# Altium project Tray2.PrjPcb (part 1 of 2)
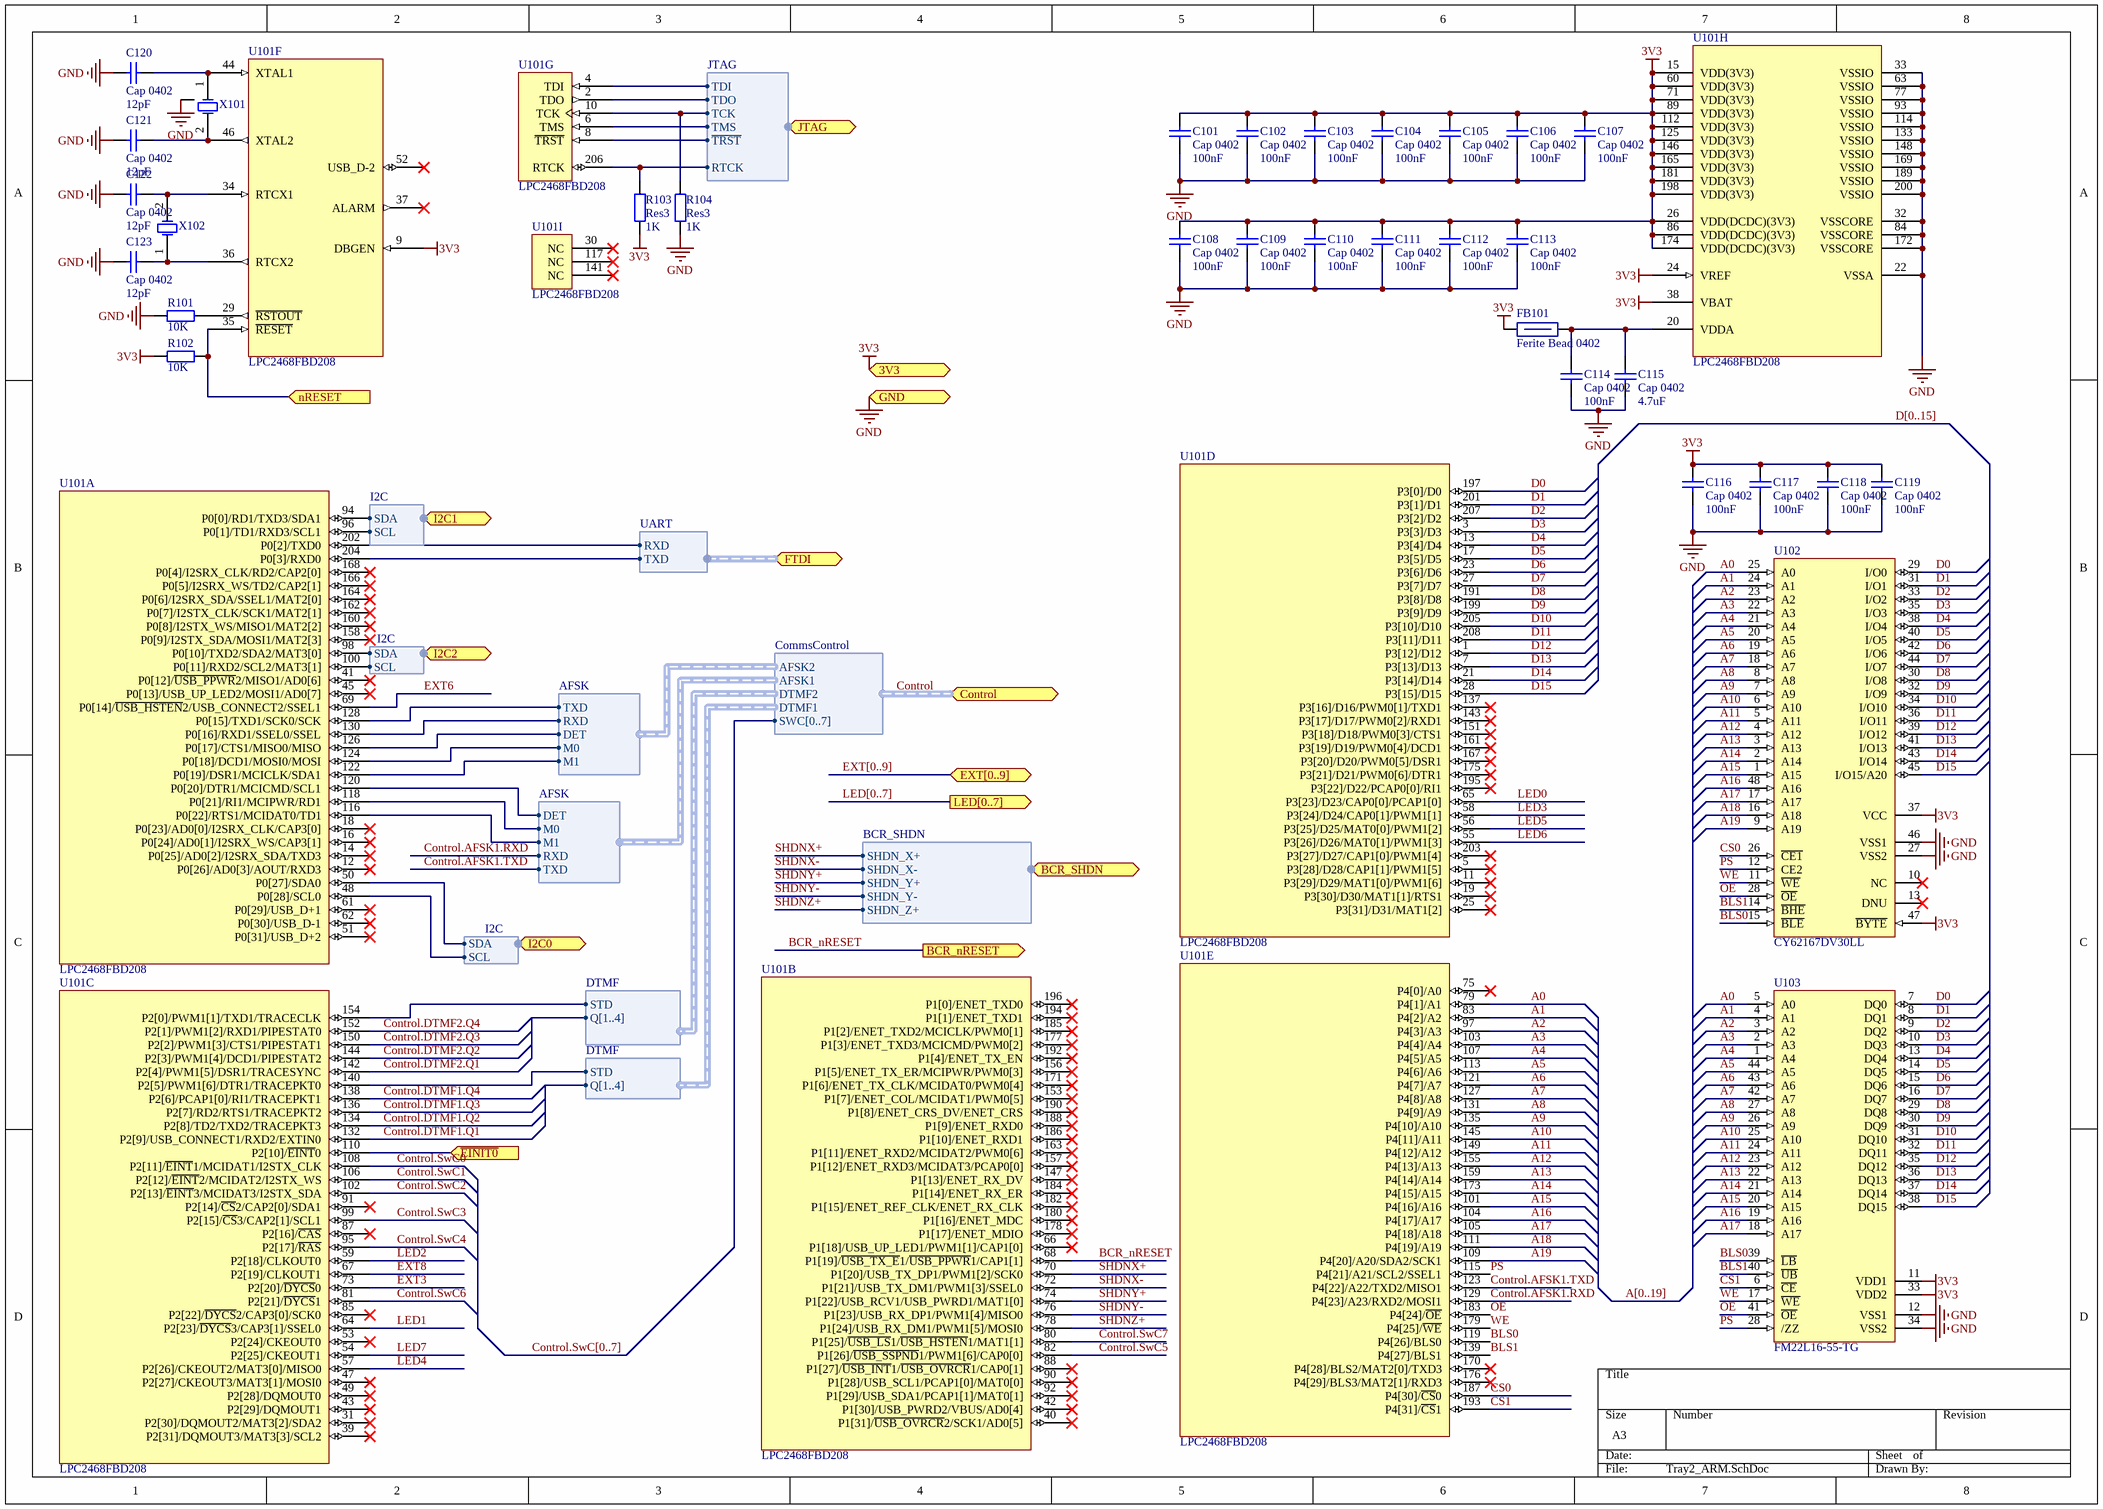
[diagram p0: Tray2_ARM.SchDoc]
7 sheets, 173 parts. Net scope: strictly hierarchical (ports join the sheet entries above them; power ports are local).
Board files: Temp_CSC.PcbDoc, Temp_PowerBoard.PcbDoc, Tray2.PcbDoc, Temp_BCR.PcbDoc
Sheets:
  Tray2_ARM.SchDoc
  Tray2_Comms_AFSK.SchDoc
  Tray2_Comms_Beacon.SchDoc
  Tray2_Comms_DTMF.SchDoc
  Tray2_Comms_SwC.SchDoc
  Tray2_Power.SchDoc
  Tray2_BCR.SchDoc

## Sheet Tray2_ARM.SchDoc
size A3; PageSetup: Record=PageOptions|CenterHorizontal=True|CenterVertical=True|PrintScale=0.97|XCorrection=1.00|YCorrection=1.00|PrintKind=1|BorderSize=5000000|LeftOffset=0|BottomOffset=0|Orientation=2|PaperLength=2970|PaperWidth=2100|Scale=100|PaperSource=7|PrintQuality=1200|MediaType=1|DitherType=10|PaperKind=A4|PrintScaleMode=1

### Parts
C101  Cap 0402  value 100nF  [CAPC1005X06L]
C102  Cap 0402  value 100nF  [CAPC1005X06L]
C103  Cap 0402  value 100nF  [CAPC1005X06L]
C104  Cap 0402  value 100nF  [CAPC1005X06L]
C105  Cap 0402  value 100nF  [CAPC1005X06L]
C106  Cap 0402  value 100nF  [CAPC1005X06L]
C107  Cap 0402  value 100nF  [CAPC1005X06L]
C108  Cap 0402  value 100nF  [CAPC1005X06L]
C109  Cap 0402  value 100nF  [CAPC1005X06L]
C110  Cap 0402  value 100nF  [CAPC1005X06L]
C111  Cap 0402  value 100nF  [CAPC1005X06L]
C112  Cap 0402  value 100nF  [CAPC1005X06L]
C113  Cap 0402  value 100nF  [CAPC1005X06L]
C114  Cap 0402  value 100nF  [CAPC1005X06L]
C115  Cap 0402  value 4.7uF  [CAPC1005X06L]
C116  Cap 0402  value 100nF  [CAPC1005X06L]
C117  Cap 0402  value 100nF  [CAPC1005X06L]
C118  Cap 0402  value 100nF  [CAPC1005X06L]
C119  Cap 0402  value 100nF  [CAPC1005X06L]
C120  Cap 0402  value 12pF  [CAPC1005X06L]
C121  Cap 0402  value 12pF  [CAPC1005X06L]
C122  Cap 0402  value 12pF  [CAPC1005X06L]
C123  Cap 0402  value 12pF  [CAPC1005X06L]
FB101  Ferite Bead 0402  [INDC1005X06L]
R101  value 10K  [RESC1005X06L]  (hidden comment: Res3)
R102  value 10K  [RESC1005X06L]  (hidden comment: Res3)
R103  Res3  value 1K  [RESC1005X06L]
R104  Res3  value 1K  [RESC1005X06L]
U101  LPC2468FBD208  [TSQFP50P3000X3000X160-208L]  (parts A,B,C,D,E,F,G,H,I of 9)
U102  CY62167DV30LL  [TSSOP50P2000X120-48L]
U103  FM22L16-55-TG  [TSOP80P1180X120-44L]
X101  Crystal Oscilator  [7M]  (value not drawn)
X102  Crystal Oscilator  [9H T10]  (value not drawn)

### Ports
3V3 (in), BCR_nRESET (out), BCR_SHDN (harness BCR_SHDN), Control (harness CommsControl), EXT[0..9] (bidir), FTDI (harness UART), GND (in), I2C0 (harness I2C), I2C1 (harness I2C), I2C2 (harness I2C), JTAG (harness JTAG), LED[0..7] (out), nRESET (in), ~{EINIT0} (in)

### Harnesses
I2C: SDA, SCL
JTAG: TDI, TDO, TCK, TMS, ~{TRST}, RTCK
AFSK: DET, M0, M1, RXD, TXD
DTMF: Q[1..4], STD
CommsControl: AFSK1, AFSK2, DTMF1, DTMF2, SWC[0..7]
BCR_SHDN: SHDN_X+, SHDN_X-, SHDN_Y+, SHDN_Y-, SHDN_Z+
UART: RXD, TXD

### Nets
3V3: C101.2 C102.2 C103.2 C104.2 C105.2 C106.2 C107.2 C108.2 C109.2 C110.2 C111.2 C112.2 C113.2 C116.2 C117.2 C118.2 C119.2 FB101.1 R102.2 R103.2 U101.9(DBGEN) U101.15(VDD(3V3)) U101.24(VREF) U101.26(VDD(DCDC)(3V3)) U101.38(VBAT) U101.60(VDD(3V3)) U101.71(VDD(3V3)) U101.86(VDD(DCDC)(3V3)) U101.89(VDD(3V3)) U101.112(VDD(3V3)) U101.125(VDD(3V3)) U101.146(VDD(3V3)) U101.165(VDD(3V3)) U101.174(VDD(DCDC)(3V3)) U101.181(VDD(3V3)) U101.198(VDD(3V3)) U102.37(VCC) U102.47(~{BYTE}) U103.11(VDD1) U103.33(VDD2) ; port 3V3
GND: C101.1 C102.1 C103.1 C104.1 C105.1 C106.1 C107.1 C108.1 C109.1 C110.1 C111.1 C112.1 C113.1 C114.1 C115.1 C116.1 C117.1 C118.1 C119.1 C120.2 C121.1 C122.2 C123.1 R101.2 R104.2 U101.22(VSSA) U101.32(VSSCORE) U101.33(VSSIO) U101.63(VSSIO) U101.77(VSSIO) U101.84(VSSCORE) U101.93(VSSIO) U101.114(VSSIO) U101.133(VSSIO) U101.148(VSSIO) U101.169(VSSIO) U101.172(VSSCORE) U101.189(VSSIO) U101.200(VSSIO) U102.27(VSS2) U102.46(VSS1) U103.12(VSS1) U103.34(VSS2) X101.3 ; port GND
A0: U101.79(P4[1]/A1) U102.25(A0) U103.5(A0)
A1: U101.83(P4[2]/A2) U102.24(A1) U103.4(A1)
A2: U101.97(P4[3]/A3) U102.23(A2) U103.3(A2)
A3: U101.103(P4[4]/A4) U102.22(A3) U103.2(A3)
A4: U101.107(P4[5]/A5) U102.21(A4) U103.1(A4)
A5: U101.113(P4[6]/A6) U102.20(A5) U103.44(A5)
A6: U101.121(P4[7]/A7) U102.19(A6) U103.43(A6)
A7: U101.127(P4[8]/A8) U102.18(A7) U103.42(A7)
A8: U101.131(P4[9]/A9) U102.8(A8) U103.27(A8)
A9: U101.135(P4[10]/A10) U102.7(A9) U103.26(A9)
A10: U101.145(P4[11]/A11) U102.6(A10) U103.25(A10)
A11: U101.149(P4[12]/A12) U102.5(A11) U103.24(A11)
A12: U101.155(P4[13]/A13) U102.4(A12) U103.23(A12)
A13: U101.159(P4[14]/A14) U102.3(A13) U103.22(A13)
A14: U101.173(P4[15]/A15) U102.2(A14) U103.21(A14)
A15: U101.101(P4[16]/A16) U102.1(A15) U103.20(A15)
A16: U101.104(P4[17]/A17) U102.48(A16) U103.19(A16)
A17: U101.105(P4[18]/A18) U102.17(A17) U103.18(A17)
A18: U101.111(P4[19]/A19) U102.16(A18)
A19: U101.109(P4[20]/A20/SDA2/SCK1) U102.9(A19)
BCR_nRESET: U101.68(P1[19]/~{USB_TX_E}1/~{USB_PPWR}1/CAP1[1]) ; port BCR_nRESET
BLS0: U101.119(P4[26]/BLS0) U102.15(~{BLE}) U103.39(~{LB})
BLS1: U101.139(P4[27]/BLS1) U102.14(~{BHE}) U103.40(~{UB})
Control.AFSK1.RXD: U101.129(P4[23]/A23/RXD2/MOSI1) ; harness AFSK.RXD
Control.AFSK1.TXD: U101.123(P4[22]/A22/TXD2/MISO1) ; harness AFSK.TXD
Control.DTMF1.Q1: U101.132(P2[9]/USB_CONNECT1/RXD2/EXTIN0)
Control.DTMF1.Q2: U101.134(P2[8]/TD2/TXD2/TRACEPKT3)
Control.DTMF1.Q3: U101.136(P2[7]/RD2/RTS1/TRACEPKT2)
Control.DTMF1.Q4: U101.138(P2[6]/PCAP1[0]/RI1/TRACEPKT1)
Control.DTMF2.Q1: U101.142(P2[4]/PWM1[5]/DSR1/TRACESYNC)
Control.DTMF2.Q2: U101.144(P2[3]/PWM1[4]/DCD1/PIPESTAT2)
Control.DTMF2.Q3: U101.150(P2[2]/PWM1[3]/CTS1/PIPESTAT1)
Control.DTMF2.Q4: U101.152(P2[1]/PWM1[2]/RXD1/PIPESTAT0)
Control.SwC0: U101.108(P2[11]/~{EINT}1/MCIDAT1/I2STX_CLK)
Control.SwC1: U101.106(P2[12]/~{EINT}2/MCIDAT2/I2STX_WS)
Control.SwC2: U101.102(P2[13]/~{EINT}3/MCIDAT3/I2STX_SDA)
Control.SwC3: U101.99(P2[15]/~{CS}3/CAP2[1]/SCL1)
Control.SwC4: U101.95(P2[17]/~{RAS})
Control.SwC5: U101.82(P1[26]/~{USB_SSPND}1/PWM1[6]/CAP0[0])
Control.SwC6: U101.81(P2[21]/~{DYCS}1)
Control.SwC7: U101.80(P1[25]/~{USB_LS}1/~{USB_HSTEN}1/MAT1[1])
CS0: U101.187(P4[30]/~{CS}0) U102.26(~{CE1})
CS1: U101.193(P4[31]/~{CS}1) U103.6(~{CE})
D0: U101.197(P3[0]/D0) U102.29(I/O0) U103.7(DQ0)
D1: U101.201(P3[1]/D1) U102.31(I/O1) U103.8(DQ1)
D2: U101.207(P3[2]/D2) U102.33(I/O2) U103.9(DQ2)
D3: U101.3(P3[3]/D3) U102.35(I/O3) U103.10(DQ3)
D4: U101.13(P3[4]/D4) U102.38(I/O4) U103.13(DQ4)
D5: U101.17(P3[5]/D5) U102.40(I/O5) U103.14(DQ5)
D6: U101.23(P3[6]/D6) U102.42(I/O6) U103.15(DQ6)
D7: U101.27(P3[7]/D7) U102.44(I/O7) U103.16(DQ7)
D8: U101.191(P3[8]/D8) U102.30(I/O8) U103.29(DQ8)
D9: U101.199(P3[9]/D9) U102.32(I/O9) U103.30(DQ9)
D10: U101.205(P3[10]/D10) U102.34(I/O10) U103.31(DQ10)
D11: U101.208(P3[11]/D11) U102.36(I/O11) U103.32(DQ11)
D12: U101.1(P3[12]/D12) U102.39(I/O12) U103.35(DQ12)
D13: U101.7(P3[13]/D13) U102.41(I/O13) U103.36(DQ13)
D14: U101.21(P3[14]/D14) U102.43(I/O14) U103.37(DQ14)
D15: U101.28(P3[15]/D15) U102.45(I/O15/A20) U103.38(DQ15)
EXT3: U101.73(P2[20]/~{DYCS}0)
EXT6: U101.69(P0[14]/~{USB_HSTEN}2/USB_CONNECT2/SSEL1)
EXT8: U101.67(P2[19]/CLKOUT1)
LED0: U101.65(P3[23]/D23/CAP0[0]/PCAP1[0])
LED1: U101.64(P2[23]/~{DYCS}3/CAP3[1]/SSEL0)
LED2: U101.59(P2[18]/CLKOUT0)
LED3: U101.58(P3[24]/D24/CAP0[1]/PWM1[1])
LED4: U101.57(P2[26]/CKEOUT2/MAT3[0]/MISO0)
LED5: U101.56(P3[25]/D25/MAT0[0]/PWM1[2])
LED6: U101.55(P3[26]/D26/MAT0[1]/PWM1[3])
LED7: U101.54(P2[25]/CKEOUT1)
OE: U101.183(P4[24]/~{OE}) U102.28(~{OE}) U103.41(~{OE})
PS: U101.115(P4[21]/A21/SCL2/SSEL1) U102.12(CE2) U103.28(/ZZ)
SHDNX+: U101.70(P1[20]/USB_TX_DP1/PWM1[2]/SCK0) ; port BCR_SHDN.SHDN_X+
SHDNX-: U101.72(P1[21]/USB_TX_DM1/PWM1[3]/SSEL0) ; port BCR_SHDN.SHDN_X-
SHDNY+: U101.74(P1[22]/USB_RCV1/USB_PWRD1/MAT1[0]) ; port BCR_SHDN.SHDN_Y+
SHDNY-: U101.76(P1[23]/USB_RX_DP1/PWM1[4]/MISO0) ; port BCR_SHDN.SHDN_Y-
SHDNZ+: U101.78(P1[24]/USB_RX_DM1/PWM1[5]/MOSI0) ; port BCR_SHDN.SHDN_Z+
WE: U101.179(P4[25]/~{WE}) U102.11(~{WE}) U103.17(~{WE})
NetC114_2: C114.2 C115.2 FB101.2 U101.20(VDDA)
NetC120_1: C120.1 U101.44(XTAL1) X101.1(OSC1)
NetC121_2: C121.2 U101.46(XTAL2) X101.2(OSC2)
NetC122_1: C122.1 U101.34(RTCX1) X102.2(OSC2)
NetC123_2: C123.2 U101.36(RTCX2) X102.1(OSC1)
NetR101_1: R101.1 U101.29(~{RSTOUT})
NetR102_1: R102.1 U101.35(~{RESET}) ; port nRESET
NetR103_1: R103.1 U101.206(RTCK) ; port JTAG.RTCK
NetR104_1: R104.1 U101.10(TCK) ; port JTAG.TCK
NetU101_2: U101.2(TDO) ; port JTAG.TDO
NetU101_4: U101.4(TDI) ; port JTAG.TDI
NetU101_6: U101.6(TMS) ; port JTAG.TMS
NetU101_8: U101.8(~{TRST}) ; port JTAG.~{TRST}
NetU101_48: U101.48(P0[28]/SCL0) ; port I2C0.SCL
NetU101_50: U101.50(P0[27]/SDA0) ; port I2C0.SDA
NetU101_94: U101.94(P0[0]/RD1/TXD3/SDA1) ; port I2C1.SDA
NetU101_96: U101.96(P0[1]/TD1/RXD3/SCL1) ; port I2C1.SCL
NetU101_98: U101.98(P0[10]/TXD2/SDA2/MAT3[0]) ; port I2C2.SDA
NetU101_100: U101.100(P0[11]/RXD2/SCL2/MAT3[1]) ; port I2C2.SCL
NetU101_110: U101.110(P2[10]/~{EINT}0) ; port ~{EINIT0}
NetU101_116: U101.116(P0[22]/RTS1/MCIDAT0/TD1) ; harness AFSK.M1
NetU101_118: U101.118(P0[21]/RI1/MCIPWR/RD1) ; harness AFSK.M0
NetU101_120: U101.120(P0[20]/DTR1/MCICMD/SCL1) ; harness AFSK.DET
NetU101_122: U101.122(P0[19]/DSR1/MCICLK/SDA1) ; harness AFSK.M1
NetU101_124: U101.124(P0[18]/DCD1/MOSI0/MOSI) ; harness AFSK.M0
NetU101_126: U101.126(P0[17]/CTS1/MISO0/MISO) ; harness AFSK.DET
NetU101_128: U101.128(P0[15]/TXD1/SCK0/SCK) ; harness AFSK.TXD
NetU101_130: U101.130(P0[16]/RXD1/SSEL0/SSEL) ; harness AFSK.RXD
NetU101_140: U101.140(P2[5]/PWM1[6]/DTR1/TRACEPKT0) ; harness DTMF.STD
NetU101_154: U101.154(P2[0]/PWM1[1]/TXD1/TRACECLK) ; harness DTMF.STD
NetU101_202: U101.202(P0[2]/TXD0) ; port FTDI.RXD
NetU101_204: U101.204(P0[3]/RXD0) ; port FTDI.TXD

Not connected (* = marked no-connect by the designer): U101 5(P3[28]/D28/CAP1[1]/PWM1[5])* 11(P3[29]/D29/MAT1[0]/PWM1[6])* 12(P0[26]/AD0[3]/AOUT/RXD3)* 14(P0[25]/AD0[2]/I2SRX_SDA/TXD3)* 16(P0[24]/AD0[1]/I2SRX_WS/CAP3[1])* 18(P0[23]/AD0[0]/I2SRX_CLK/CAP3[0])* 19(P3[30]/D30/MAT1[1]/RTS1)* 25(P3[31]/D31/MAT1[2])* 30(NC)* 31(P2[30]/DQMOUT2/MAT3[2]/SDA2)* 37(ALARM)* 39(P2[31]/DQMOUT3/MAT3[3]/SCL2)* 40(P1[31]/~{USB_OVRCR}2/SCK1/AD0[5])* 41(P0[12]/~{USB_PPWR}2/MISO1/AD0[6])* 42(P1[30]/USB_PWRD2/VBUS/AD0[4])* 43(P2[29]/DQMOUT1)* 45(P0[13]/USB_UP_LED2/MOSI1/AD0[7])* 47(P2[27]/CKEOUT3/MAT3[1]/MOSI0)* 49(P2[28]/DQMOUT0)* 51(P0[31]/USB_D+2)* 52(USB_D-2)* 53(P2[24]/CKEOUT0)* 61(P0[29]/USB_D+1)* 62(P0[30]/USB_D-1)* 66(P1[18]/USB_UP_LED1/PWM1[1]/CAP1[0])* 75(P4[0]/A0)* 85(P2[22]/~{DYCS}2/CAP3[0]/SCK0)* 87(P2[16]/~{CAS})* 88(P1[27]/~{USB_INT}1/~{USB_OVRCR}1/CAP0[1])* 90(P1[28]/USB_SCL1/PCAP1[0]/MAT0[0])* 91(P2[14]/~{CS}2/CAP2[0]/SDA1)* 92(P1[29]/USB_SDA1/PCAP1[1]/MAT0[1])* 117(NC)* 137(P3[16]/D16/PWM0[1]/TXD1)* 141(NC)* 143(P3[17]/D17/PWM0[2]/RXD1)* 147(P1[13]/ENET_RX_DV)* 151(P3[18]/D18/PWM0[3]/CTS1)* 153(P1[7]/ENET_COL/MCIDAT1/PWM0[5])* 156(P1[5]/ENET_TX_ER/MCIPWR/PWM0[3])* 157(P1[12]/ENET_RXD3/MCIDAT3/PCAP0[0])* 158(P0[9]/I2STX_SDA/MOSI1/MAT2[3])* 160(P0[8]/I2STX_WS/MISO1/MAT2[2])* 161(P3[19]/D19/PWM0[4]/DCD1)* 162(P0[7]/I2STX_CLK/SCK1/MAT2[1])* 163(P1[11]/ENET_RXD2/MCIDAT2/PWM0[6])* 164(P0[6]/I2SRX_SDA/SSEL1/MAT2[0])* 166(P0[5]/I2SRX_WS/TD2/CAP2[1])* 167(P3[20]/D20/PWM0[5]/DSR1)* 168(P0[4]/I2SRX_CLK/RD2/CAP2[0])* 170(P4[28]/BLS2/MAT2[0]/TXD3)* 171(P1[6]/ENET_TX_CLK/MCIDAT0/PWM0[4])* 175(P3[21]/D21/PWM0[6]/DTR1)* 176(P4[29]/BLS3/MAT2[1]/RXD3)* 177(P1[3]/ENET_TXD3/MCICMD/PWM0[2])* 178(P1[17]/ENET_MDIO)* 180(P1[16]/ENET_MDC)* 182(P1[15]/ENET_REF_CLK/ENET_RX_CLK)* 184(P1[14]/ENET_RX_ER)* 185(P1[2]/ENET_TXD2/MCICLK/PWM0[1])* 186(P1[10]/ENET_RXD1)* 188(P1[9]/ENET_RXD0)* 190(P1[8]/ENET_CRS_DV/ENET_CRS)* 192(P1[4]/ENET_TX_EN)* 194(P1[1]/ENET_TXD1)* 195(P3[22]/D22/PCAP0[0]/RI1)* 196(P1[0]/ENET_TXD0)* 203(P3[27]/D27/CAP1[0]/PWM1[4])*; U102 10(NC)* 13(DNU)*

### Buses and harness runs
bus A[0..19]
bus Control.SwC[0..7]
bus D[0..15]
bus EXT[0..9] = port EXT[0..9]
bus LED[0..7] = port LED[0..7]
harness Control = port Control

### Library data of the parts
C101-C123 = Cap 0402: Capacitor; Published: 8-Jun-2000; LatestRevisionDate: 17-Jul-2002; LatestRevisionNote: Re-released for DXP Platform.; PackageReference: RAD-0.3; Publisher: Altium Limited; PackageDescription: Radial Cap, Thru-Hole; 2 Leads; 0.3 in Pin Spacing
FB101 = FB_0402: Ferite Bead : 0402; Published: 8-Jun-2000; LatestRevisionDate: 29-May-2009; LatestRevisionNote: IPC-7351 Footprint Added.; PackageReference: J1-0603; Publisher: Altium Limited; PackageDescription: Chip Resistor
R101-R104 = Res3: Resistor; Published: 8-Jun-2000; LatestRevisionDate: 29-May-2009; LatestRevisionNote: IPC-7351 Footprint Added.; PackageReference: J1-0603; Publisher: Altium Limited; PackageDescription: Chip Resistor
U101 = LPC2468FBD208: ARM7 16/32-Bit Microcontroller, 512KB Flash, 98KB RAM, 208-Lead LQFP; Code_IEC: 136E30; Published: 17-Aug-2007; DatasheetVersion: rev.01, Jul-2007; PackageVersion: Feb-2003; PackageReference: SOT459-1; Publisher: Altium Limited; PackageDescription: 208-Pin Plastic Low Profile Quad Flat Pack, LQFP208; Code_JEDEC: MS-026; ComponentLink1Description: Manufacturer Link; ComponentLink1URL: http://www.nxp.com/; ComponentLink2Description: Datasheet; ComponentLink2URL: http://www.standardics.nxp.com/products/lpc2000/datasheet/lpc2468.pdf
U102 = CY62167DV30LL: 16-Mbit (1M x 16) Static RAM; ColumnAddress: A0-A9; Publisher: Altium Limited; ComponentLink1Description: Manufacturer Link; ComponentLink2Description: Datasheet
U103 = FM22L16-55-TG: FRAM, 2MB, 3V, 60NS, 44TSOP2; ColumnAddress: A0-A9; LatestRevisionDate: 13-Apr-2006; DatasheetVersion: rev1.1, Feb-2004; PackageReference: TSOP2-44_M; PackageDescription: 44-Pin Small Outline Package 0.8 mm Pitch; ComponentLink1Description: Manufacturer Link; ComponentLink2Description: Datasheet
X101 = C.O. 4pins: Crystal Oscillator; Value: 12.000MHz; Published: 8-Jun-2000; LatestRevisionDate: 17-Jul-2002; LatestRevisionNote: Re-released for DXP Platform.; PackageReference: R38; Publisher: Altium Limited
X102 = C.O. 2pins: Crystal Oscillator; Value: 12.000MHz; Published: 8-Jun-2000; LatestRevisionDate: 17-Jul-2002; LatestRevisionNote: Re-released for DXP Platform.; PackageReference: R38; Publisher: Altium Limited

## Sheet Tray2_Comms_AFSK.SchDoc: BLUEsat AFSK Modem
size A3; DrawnBy: Mitch Wenke, Chris Webb, Thomas Fisk; Engineer: C. WEBB, M. WENKE; Organization: BLUEsat Project; Address1: Room 419; Address2: School of EE&T; Address3: UNSW, NSW 2052; Address4: Australia; DocumentNumber: COMS0002; SheetNumber: 1; SheetTotal: 1; Description: AFSK modem based on CML MX614 IC; Version: 1.0
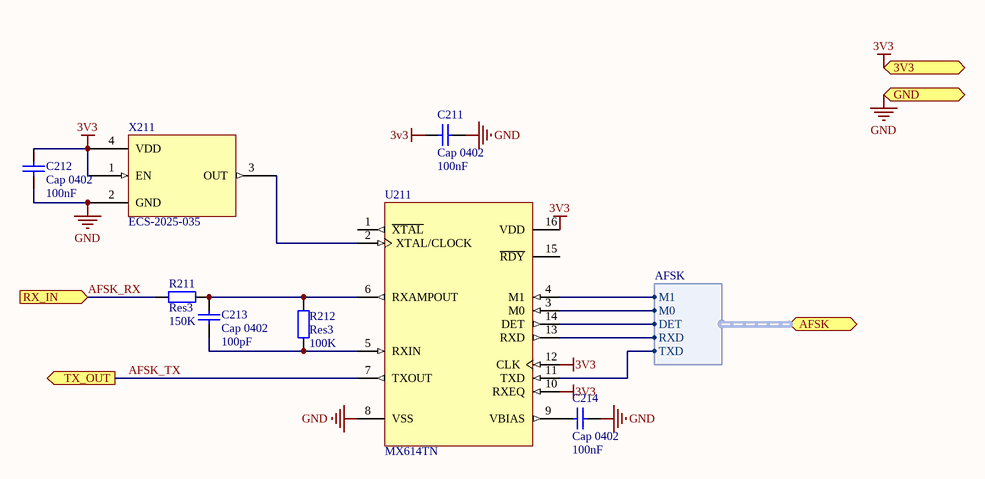
[diagram p1: Tray2_Comms_AFSK.SchDoc]

### Parts
C211  Cap 0402  value 100nF  [CAPC1005X06L]
C212  Cap 0402  value 100nF  [CAPC1005X06L]
C213  Cap 0402  value 100pF  [CAPC1005X06L]
C214  Cap 0402  value 100nF  [CAPC1005X06L]
R211  Res3  value 150K  [RESC1005X06L]
R212  Res3  value 100K  [RESC1005X06L]
U211  MX614TN  [SOIC16]
X211  ECS-2025-035  [ECS-2025]

### Ports
3V3 (in), AFSK (harness AFSK), GND (in), RX_IN (in), TX_OUT (out)

### Harnesses
AFSK: DET, M0, M1, RXD, TXD

### Nets
3V3: C211.2 C212.2 U211.10(RXEQ) U211.12(CLK) U211.16(VDD) X211.1(EN) X211.4(VDD) ; port 3V3
GND: C211.1 C212.1 C214.1 U211.8(VSS) X211.2(GND) ; port GND
AFSK_RX: R211.2 ; port RX_IN
AFSK_TX: U211.7(TXOUT) ; port TX_OUT
NetC213_1: C213.1 R212.2 U211.5(RXIN)
NetC213_2: C213.2 R211.1 R212.1 U211.6(RXAMPOUT)
NetC214_2: C214.2 U211.9(VBIAS)
NetU211_2: U211.2(XTAL/CLOCK) X211.3(OUT)
NetU211_3: U211.3(M0) ; port AFSK.M0
NetU211_4: U211.4(M1) ; port AFSK.M1
NetU211_11: U211.11(TXD) ; port AFSK.TXD
NetU211_13: U211.13(RXD) ; port AFSK.RXD
NetU211_14: U211.14(DET) ; port AFSK.DET

Not connected (* = marked no-connect by the designer): U211 1(~{XTAL}) 15(~{RDY})

### Notes on the sheet
- Title
- Description:
- Size:
- Author:
- Date:
- A3
- Time:
- Version
- Sheet:
- Drawing No.:
- of
- File:

### Library data of the parts
C211-C214 = Cap 0402: Capacitor; Published: 8-Jun-2000; LatestRevisionDate: 17-Jul-2002; LatestRevisionNote: Re-released for DXP Platform.; PackageReference: RAD-0.3; Publisher: Altium Limited; PackageDescription: Radial Cap, Thru-Hole; 2 Leads; 0.3 in Pin Spacing
R211 R212 = Res3: Resistor; Published: 8-Jun-2000; LatestRevisionDate: 29-May-2009; LatestRevisionNote: IPC-7351 Footprint Added.; PackageReference: J1-0603; Publisher: Altium Limited; PackageDescription: Chip Resistor
U211 = MX614TN: Bell 202 Compatible Modem
X211 = ECS-2025-035: SMD Clock Oscillator, 3.579545MHz

## Sheet Tray2_Comms_Beacon.SchDoc: BLUEsat Beacon
size A3; Author: Daniel Jedrychowski; Engineer: D. JEDRYCHOWSKI; Organization: BLUEsat Project; Address1: Room 419; Address2: School of EE&T; Address3: UNSW, NSW 2052; Address4: Australia; DocumentNumber: COMS0001; SheetNumber: 1; SheetTotal: 1; Description: Morse code continuous wave beacon based on EPROM; Version: 1.1
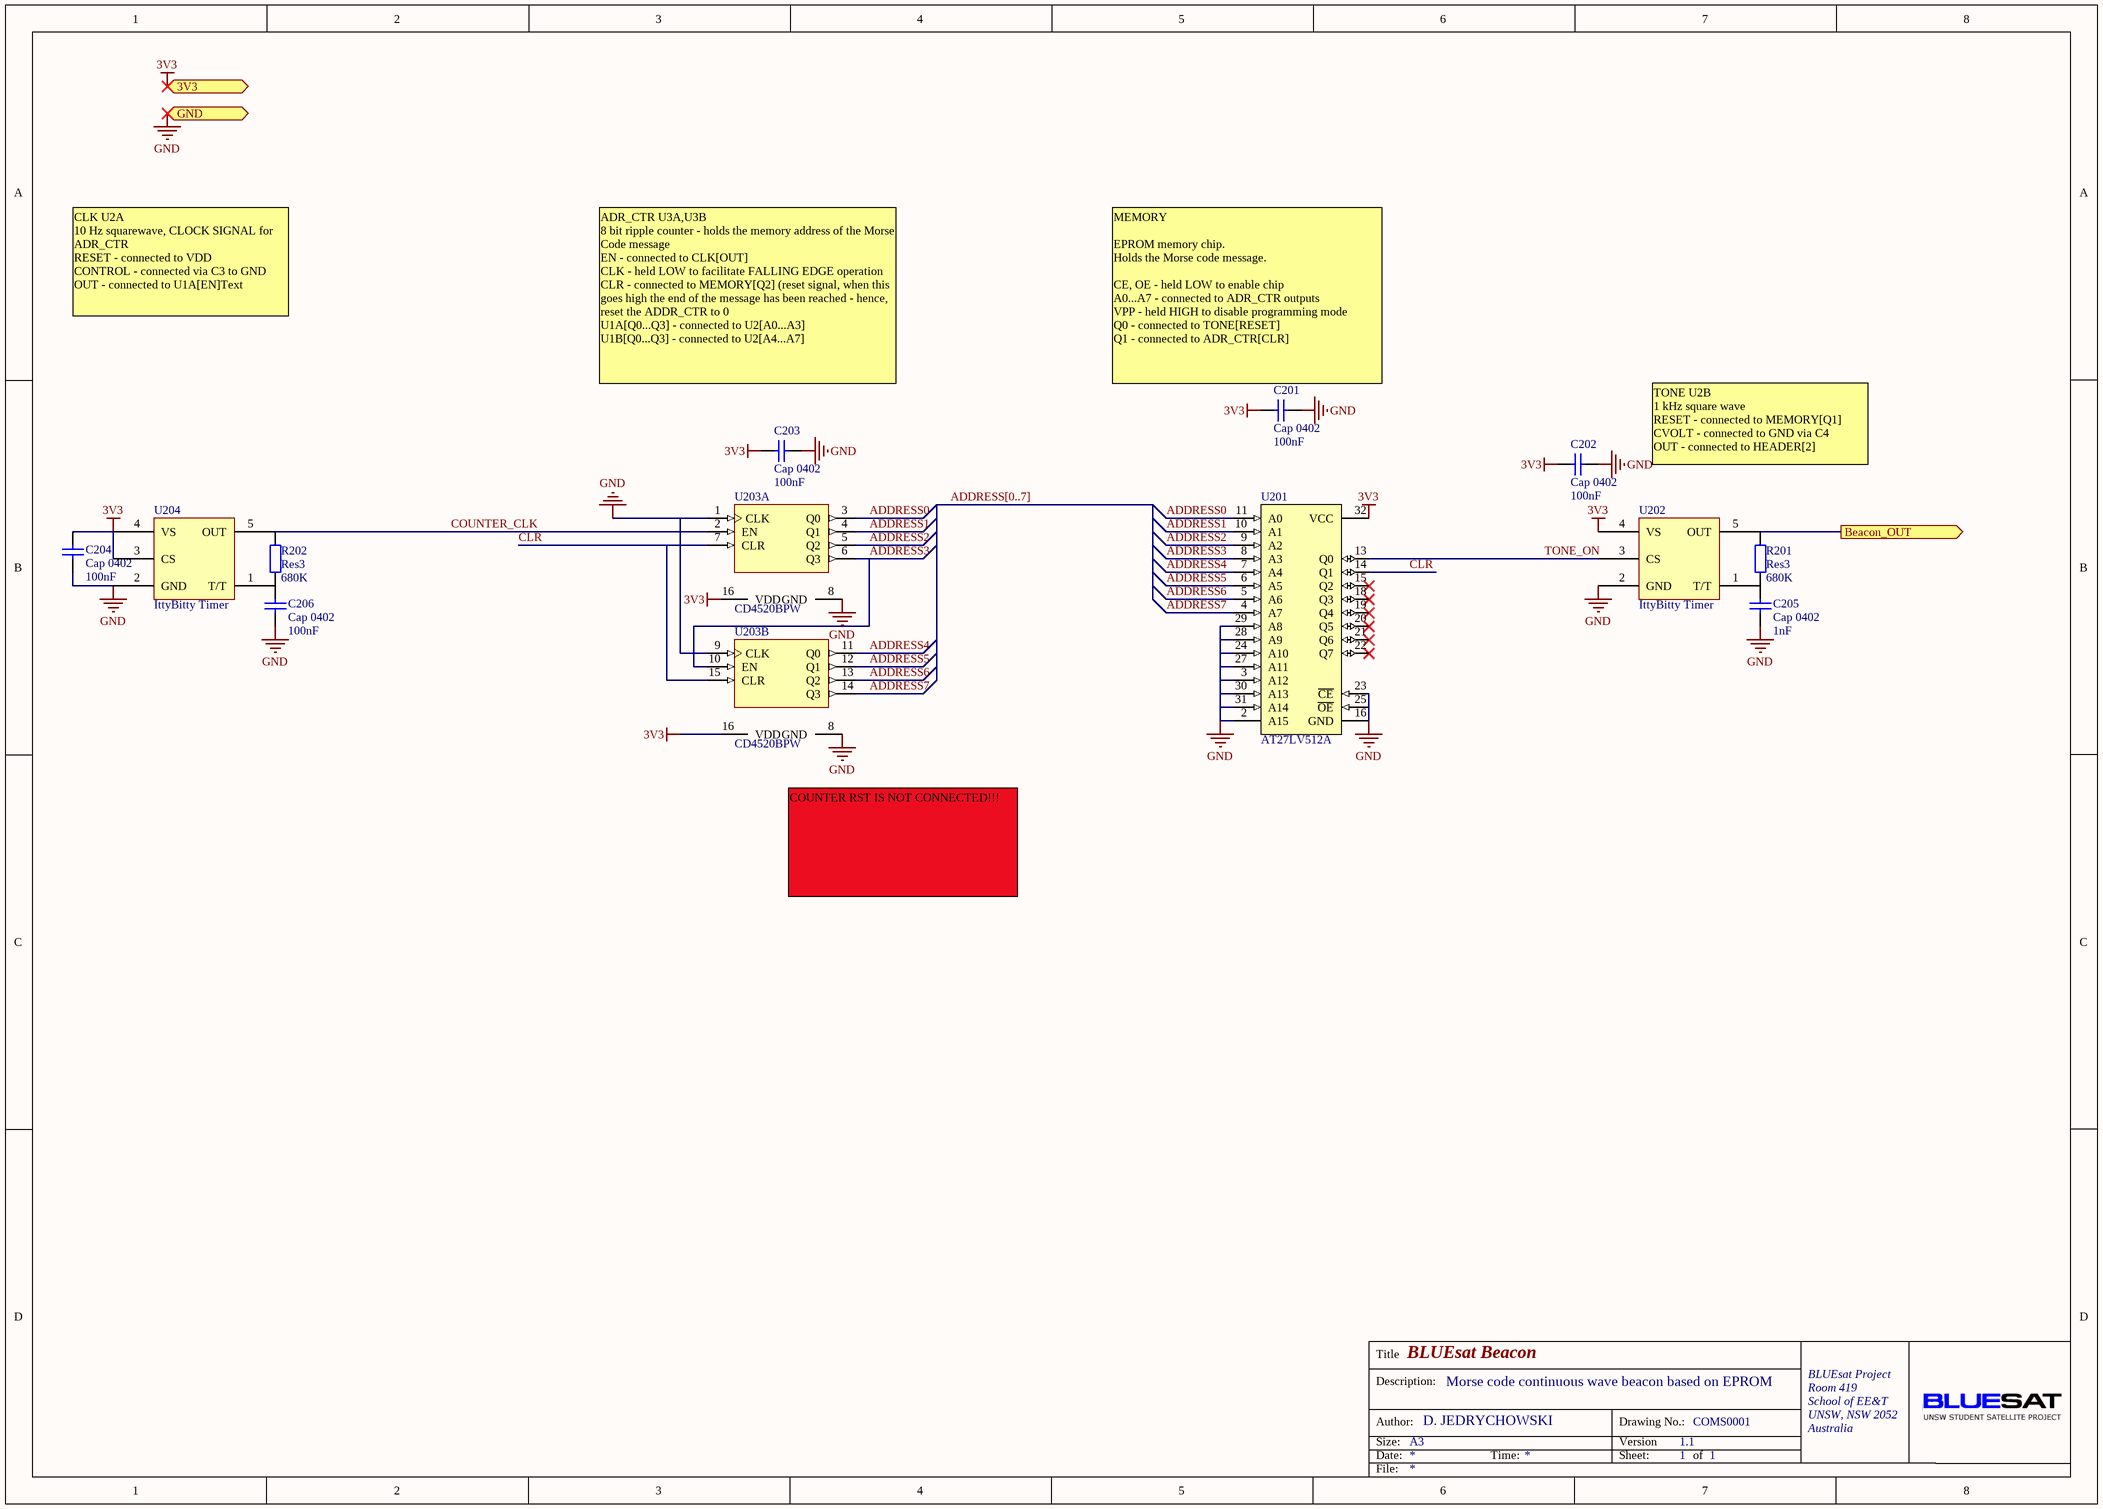
[diagram p2: Tray2_Comms_Beacon.SchDoc]

### Parts
C201  Cap 0402  value 100nF  [CAPC1005X06L]
C202  Cap 0402  value 100nF  [CAPC1005X06L]
C203  Cap 0402  value 100nF  [CAPC1005X06L]
C204  Cap 0402  value 100nF  [CAPC1005X06L]
C205  Cap 0402  value 1nF  [CAPC1005X06L]
C206  Cap 0402  value 100nF  [CAPC1005X06L]
R201  Res3  value 680K  [RESC1005X06L]
R202  Res3  value 680K  [RESC1005X06L]
U201  AT27LV512A  [PLCC7*9]
U202  IttyBitty Timer  [SOT23-5]
U203  CD4520BPW  [TSSOP16]  (parts A,B of 2)
U204  IttyBitty Timer  [SOT23-5]

### Ports
3V3 (in), Beacon_OUT (out), GND (in)

### Nets
3V3: C201.1 C202.1 C203.1 C204.2 U201.32(VCC) U202.4(VS) U203.16(VDD) U204.3(CS) U204.4(VS) ; port 3V3
GND: C201.2 C202.2 C203.2 C204.1 C205.1 C206.1 U201.2(A15) U201.3(A12) U201.16(GND) U201.23(~{CE}) U201.24(A10) U201.25(~{OE}) U201.27(A11) U201.28(A9) U201.29(A8) U201.30(A13) U201.31(A14) U202.2(GND) U203.1(CLK) U203.8(GND) U203.9(CLK) U204.2(GND) ; port GND
ADDRESS0: U201.11(A0) U203.3(Q0)
ADDRESS1: U201.10(A1) U203.4(Q1)
ADDRESS2: U201.9(A2) U203.5(Q2)
ADDRESS3: U201.8(A3) U203.6(Q3) U203.10(EN)
ADDRESS4: U201.7(A4) U203.11(Q0)
ADDRESS5: U201.6(A5) U203.12(Q1)
ADDRESS6: U201.5(A6) U203.13(Q2)
ADDRESS7: U201.4(A7) U203.14(Q3)
CLR: U201.14(Q1) U203.7(CLR) U203.15(CLR)
COUNTER_CLK: R202.1 U203.2(EN) U204.5(OUT)
TONE_ON: U201.13(Q0) U202.3(CS)
NetC205_2: C205.2 R201.2 U202.1(T/T)
NetC206_2: C206.2 R202.2 U204.1(T/T)
NetR201_1: R201.1 U202.5(OUT) ; port Beacon_OUT

Not connected (* = marked no-connect by the designer): U201 15(Q2)* 18(Q3)* 19(Q4)* 20(Q5)* 21(Q6)* 22(Q7)*

### Buses and harness runs
bus ADDRESS[0..7]

### Notes on the sheet
- CLK U2A
  10 Hz squarewave, CLOCK SIGNAL for ADR_CTR
  RESET - connected to VDD
  CONTROL - connected via C3 to GND
  OUT - connected to U1A[EN]Text
- ADR_CTR U3A,U3B
  8 bit ripple counter - holds the memory address of the Morse Code message
  EN - connected to CLK[OUT]
  CLK - held LOW to facilitate FALLING EDGE operation
  CLR - connected to MEMORY[Q2] (reset signal, when this goes high the end of the message has been reached - hence, reset the ADDR_CTR to 0
  U1A[Q0...Q3] - connected to U2[A0...A3]
  U1B[Q0...Q3] - connected to U2[A4...A7]
- (near C201) MEMORY
  EPROM memory chip.
  Holds the Morse code message.
  CE, OE - held LOW to enable chip
  A0...A7 - connected to ADR_CTR outputs
  VPP - held HIGH to disable programming mode
  Q0 - connected to TONE[RESET]
  Q1 - connected to ADR_CTR[CLR]
- TONE U2B
  1 kHz square wave
  RESET - connected to MEMORY[Q1]
  CVOLT - connected to GND via C4
  OUT - connected to HEADER[2]
- COUNTER RST IS NOT CONNECTED!!!
- Title
- Description:
- Size:
- Author:
- Date:
- A3
- Time:
- Version
- Sheet:
- Drawing No.:
- of
- File:

### Library data of the parts
C201-C206 = Cap 0402: Capacitor; Published: 8-Jun-2000; LatestRevisionDate: 17-Jul-2002; LatestRevisionNote: Re-released for DXP Platform.; PackageReference: RAD-0.3; Publisher: Altium Limited; PackageDescription: Radial Cap, Thru-Hole; 2 Leads; 0.3 in Pin Spacing
R201 R202 = Res3: Resistor; Published: 8-Jun-2000; LatestRevisionDate: 29-May-2009; LatestRevisionNote: IPC-7351 Footprint Added.; PackageReference: J1-0603; Publisher: Altium Limited; PackageDescription: Chip Resistor
U201 = AT27LV512A: 512 Kbit (32Kb X 8) UV EPROM and OTP EPROM; Published: 24-Aug-2001; LatestRevisionDate: 06-Jun-2005; LatestRevisionNote: Stylized 3D Model Added.; DatasheetVersion: Jul-1998; PackageVersion: Jan-2003; PackageReference: PDIP28; Publisher: Altium Limited; PackageDescription: DIP; 28 Leads; Row Spacing 15.24 mm; Pitch 2.54 mm; ComponentLink1Description: Manufacturer Link; ComponentLink1URL: http://www.st.com/; ComponentLink2Description: Datasheet; ComponentLink2URL: http://www.st.com/stonline/products/literature/ds/2384/m27c256b.pdf; Supplier 1: Digi-Key; Supplier Part Number 1: AT27LV256A-70RC-ND
U202 U204 = MIC1557: Miniature Astable Timer Chip; Supplier: Farnell; Supplier Part Number: 1517241
U203 = CD4520BPW: Dual Binary Up-Counter; Supplier 1: Farnell; Supplier Part Number 1: 1752815

## Sheet Tray2_Comms_DTMF.SchDoc: BLUEsat DTMF receiver
size A3; DrawnBy: Thomas Fisk; Engineer: T. FISK; Organization: BLUEsat Project; Address1: Room 419; Address2: School of EE&T; Address3: UNSW, NSW 2052; Address4: Australia; DocumentNumber: COMS0003; SheetNumber: 1; SheetTotal: 1; Description: DTMF decoder for telecommand interface; Version: 1.0
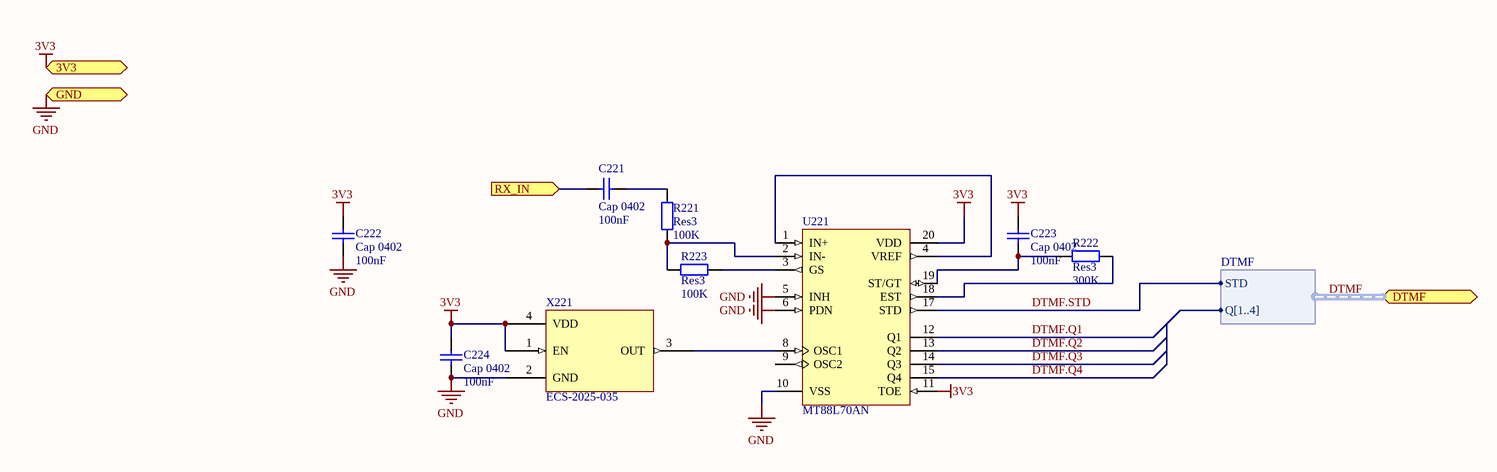
[diagram p3: Tray2_Comms_DTMF.SchDoc]

### Parts
C221  Cap 0402  value 100nF  [CAPC1005X06L]
C222  Cap 0402  value 100nF  [CAPC1005X06L]
C223  Cap 0402  value 100nF  [CAPC1005X06L]
C224  Cap 0402  value 100nF  [CAPC1005X06L]
R221  Res3  value 100K  [RESC1005X06L]
R222  Res3  value 300K  [RESC1005X06L]
R223  Res3  value 100K  [RESC1005X06L]
U221  MT88L70AN  [TSSOP20]
X221  ECS-2025-035  [ECS-2025]

### Ports
3V3 (in), DTMF (harness DTMF), GND (in), RX_IN (in)

### Harnesses
DTMF: STD, Q[1..4]

### Nets
3V3: C222.2 C223.1 C224.1 U221.11(TOE) U221.20(VDD) X221.1(EN) X221.4(VDD) ; port 3V3
GND: C222.1 C224.2 U221.5(INH) U221.6(PDN) U221.10(VSS) X221.2(GND) ; port GND
DTMF.Q1: U221.12(Q1)
DTMF.Q2: U221.13(Q2)
DTMF.Q3: U221.14(Q3)
DTMF.Q4: U221.15(Q4)
DTMF.STD: U221.17(STD) ; port DTMF.STD
NetC221_1: C221.1 R221.1
NetC221_2: C221.2 ; port RX_IN
NetC223_2: C223.2 R222.1 U221.19(ST/GT)
NetR221_2: R221.2 R223.1 U221.2(IN-)
NetR222_2: R222.2 U221.18(EST)
NetR223_2: R223.2 U221.3(GS)
NetU221_1: U221.1(IN+) U221.4(VREF)
NetU221_8: U221.8(OSC1) X221.3(OUT)

Not connected (* = marked no-connect by the designer): U221 9(OSC2)

### Buses and harness runs
harness DTMF = port DTMF

### Notes on the sheet
- Title
- Description:
- Size:
- Author:
- Date:
- A3
- Time:
- Version
- Sheet:
- Drawing No.:
- of
- File:

### Library data of the parts
C221-C224 = Cap 0402: Capacitor; Published: 8-Jun-2000; LatestRevisionDate: 17-Jul-2002; LatestRevisionNote: Re-released for DXP Platform.; PackageReference: RAD-0.3; Publisher: Altium Limited; PackageDescription: Radial Cap, Thru-Hole; 2 Leads; 0.3 in Pin Spacing
R221-R223 = Res3: Resistor; Published: 8-Jun-2000; LatestRevisionDate: 29-May-2009; LatestRevisionNote: IPC-7351 Footprint Added.; PackageReference: J1-0603; Publisher: Altium Limited; PackageDescription: Chip Resistor
U221 = MT88L70AN: 3 Volt Integrated DTMF Receiver; Published: 8-Jun-2000; LatestRevisionDate: 13-Apr-2006; LatestRevisionNote: IPC-7351 Footprint Added.; DatasheetVersion: Issue 4 March 1997; PackageVersion: 1997; PackageReference: SOIC18; Publisher: Altium Limited; PackageDescription: 18-Pin Small Outline Integrated Circuit 1.27 mm Pitch; Code_JEDEC: MS-013-AB; ComponentLink1Description: Manufacturer Link; ComponentLink1URL: http://products.zarlink.com; ComponentLink2Description: Datasheet; ComponentLink2URL: http://assets.zarlink.com/DS/zarlink_MT88L70_MAY_05.pdf; Supplier 1: Allied; Supplier Part Number 1: 090-SPEC
X221 = ECS-2025-035: SMD Clock Oscillator, 3.579545MHz

## Sheet Tray2_Comms_SwC.SchDoc: BLUEsat Switching Circuit Overview
size A3; Engineer: D. JEDRYCHOWSKI; Organization: BLUEsat Project; Address1: Room 419; Address2: School of EE&T; Address3: UNSW, NSW 2052; Address4: Australia; DocumentNumber: COMS0004; SheetNumber: 1; SheetTotal: 4; Description: Overview of Switching Circuit; Version: 1.0
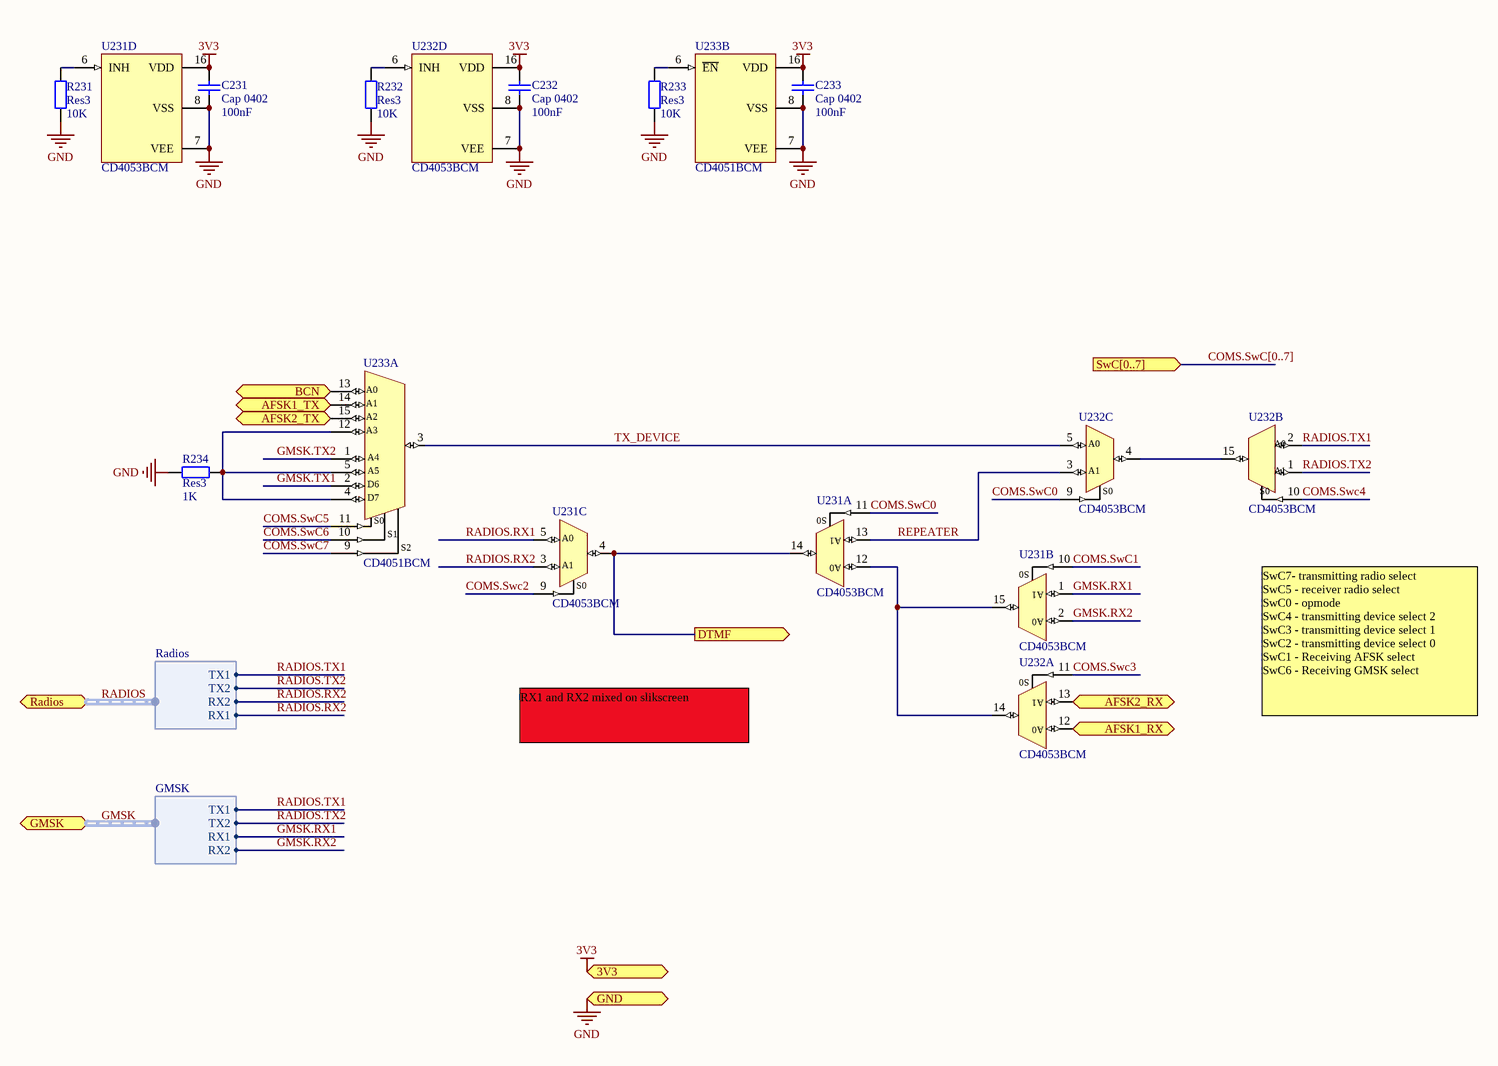
[diagram p4: Tray2_Comms_SwC.SchDoc]

### Parts
C231  Cap 0402  value 100nF  [CAPC1005X06L]
C232  Cap 0402  value 100nF  [CAPC1005X06L]
C233  Cap 0402  value 100nF  [CAPC1005X06L]
R231  Res3  value 10K  [RESC1005X06L]
R232  Res3  value 10K  [RESC1005X06L]
R233  Res3  value 10K  [RESC1005X06L]
R234  Res3  value 1K  [RESC1005X06L]
U231  CD4053BCM  [TSSOP16]  (parts A,B,C,D of 4)
U232  CD4053BCM  [TSSOP16]  (parts A,B,C,D of 4)
U233  CD4051BCM  [TSSOP16]  (parts A,B of 2)

### Ports
3V3 (in), AFSK1_RX (out), AFSK1_TX (in), AFSK2_RX (out), AFSK2_TX (in), BCN (in), DTMF (out), GMSK (harness GMSK), GND (in), Radios (harness Radios), SwC[0..7] (in)

### Harnesses
Radios: RX1, RX2, TX1, TX2
GMSK: RX1, RX2, TX1, TX2

### Nets
3V3: C231.2 C232.2 C233.2 U231.16(VDD) U232.16(VDD) U233.16(VDD) ; port 3V3
GND: C231.1 C232.1 C233.1 R231.2 R232.2 R233.2 R234.1 U231.7(VEE) U231.8(VSS) U232.7(VEE) U232.8(VSS) U233.7(VEE) U233.8(VSS) ; port GND
COMS.SwC0: U231.11(A) U232.9(C)
COMS.SwC1: U231.10(B)
COMS.Swc2: U231.9(C)
COMS.Swc3: U232.11(A)
COMS.Swc4: U232.10(B)
COMS.SwC5: U233.11(S0)
COMS.SwC6: U233.10(S1)
COMS.SwC7: U233.9(S2)
GMSK.RX1: U231.1(by) ; port GMSK.RX1
GMSK.RX2: U231.2(bx) ; port GMSK.RX2
GMSK.TX1: U233.2(A6)
GMSK.TX2: U233.1(A4)
RADIOS.RX1: U231.5(cx)
RADIOS.RX2: U231.3(cy) ; port Radios.RX1, port Radios.RX2  [project net RADIOS.RX1]
RADIOS.TX1: U232.2(bx) ; port Radios.TX1, port GMSK.TX1  [project net GMSK.TX1]
RADIOS.TX2: U232.1(by) ; port Radios.TX2, port GMSK.TX2  [project net GMSK.TX2]
REPEATER: U231.13(A1) U232.3(cy)
TX_DEVICE: U232.5(cx) U233.3(O)
NetR231_1: R231.1 U231.6(INH)
NetR232_1: R232.1 U232.6(INH)
NetR233_1: R233.1 U233.6(~{EN})
NetR234_2: R234.2 U233.4(A7) U233.5(A5) U233.12(A3)
NetU231_4: U231.4(c_out) U231.14(A_out) ; port DTMF
NetU231_12: U231.12(A0) U231.15(b_out) U232.14(A_out)
NetU232_4: U232.4(c_out) U232.15(b_out)
NetU232_12: U232.12(A0) ; port AFSK1_RX
NetU232_13: U232.13(A1) ; port AFSK2_RX
NetU233_13: U233.13(A0) ; port BCN
NetU233_14: U233.14(A1) ; port AFSK1_TX
NetU233_15: U233.15(A2) ; port AFSK2_TX

### Buses and harness runs
bus COMS.SwC[0..7] = port SwC[0..7]
harness GMSK = port GMSK
harness RADIOS = port Radios

### Notes on the sheet
- RX1 and RX2 mixed on slikscreen
- SwC7- transmitting radio select
  SwC5 - receiver radio select
  SwC0 - opmode
  SwC4 - transmitting device select 2
  SwC3 - transmitting device select 1
  SwC2 - transmitting device select 0
  SwC1 - Receiving AFSK select
  SwC6 - Receiving GMSK select
- Title
- Description:
- Size:
- Author:
- Date:
- A3
- Time:
- Version
- Sheet:
- Drawing No.:
- of
- File:
- (in symbol CD4051BCM, part A) D6; D7
- (in symbol CD4053BCM, part A) S0
- (in symbol CD4053BCM, part B) S0
- (in symbol CD4053BCM, part C) S0

### Library data of the parts
C231-C233 = Cap 0402: Capacitor; Published: 8-Jun-2000; LatestRevisionDate: 17-Jul-2002; LatestRevisionNote: Re-released for DXP Platform.; PackageReference: RAD-0.3; Publisher: Altium Limited; PackageDescription: Radial Cap, Thru-Hole; 2 Leads; 0.3 in Pin Spacing
R231-R234 = Res3: Resistor; Published: 8-Jun-2000; LatestRevisionDate: 29-May-2009; LatestRevisionNote: IPC-7351 Footprint Added.; PackageReference: J1-0603; Publisher: Altium Limited; PackageDescription: Chip Resistor
U231 U232 = CD4053BCM: Triple 2-Channnel Analog Multiplexer/Demutiplexer; Supplier 1: Farnell; Supplier Part Number 1: 2132284
U233 = CD4051BCM: 8-Channel Analog Multiplexer/Demultiplexer; Datasheet Link: http://focus.ti.com/lit/ds/symlink/cd4052b.pdf; Supplier 1: Farnell; Supplier Part Number 1: 1753421

## Sheet Tray2_Power.SchDoc
size A3
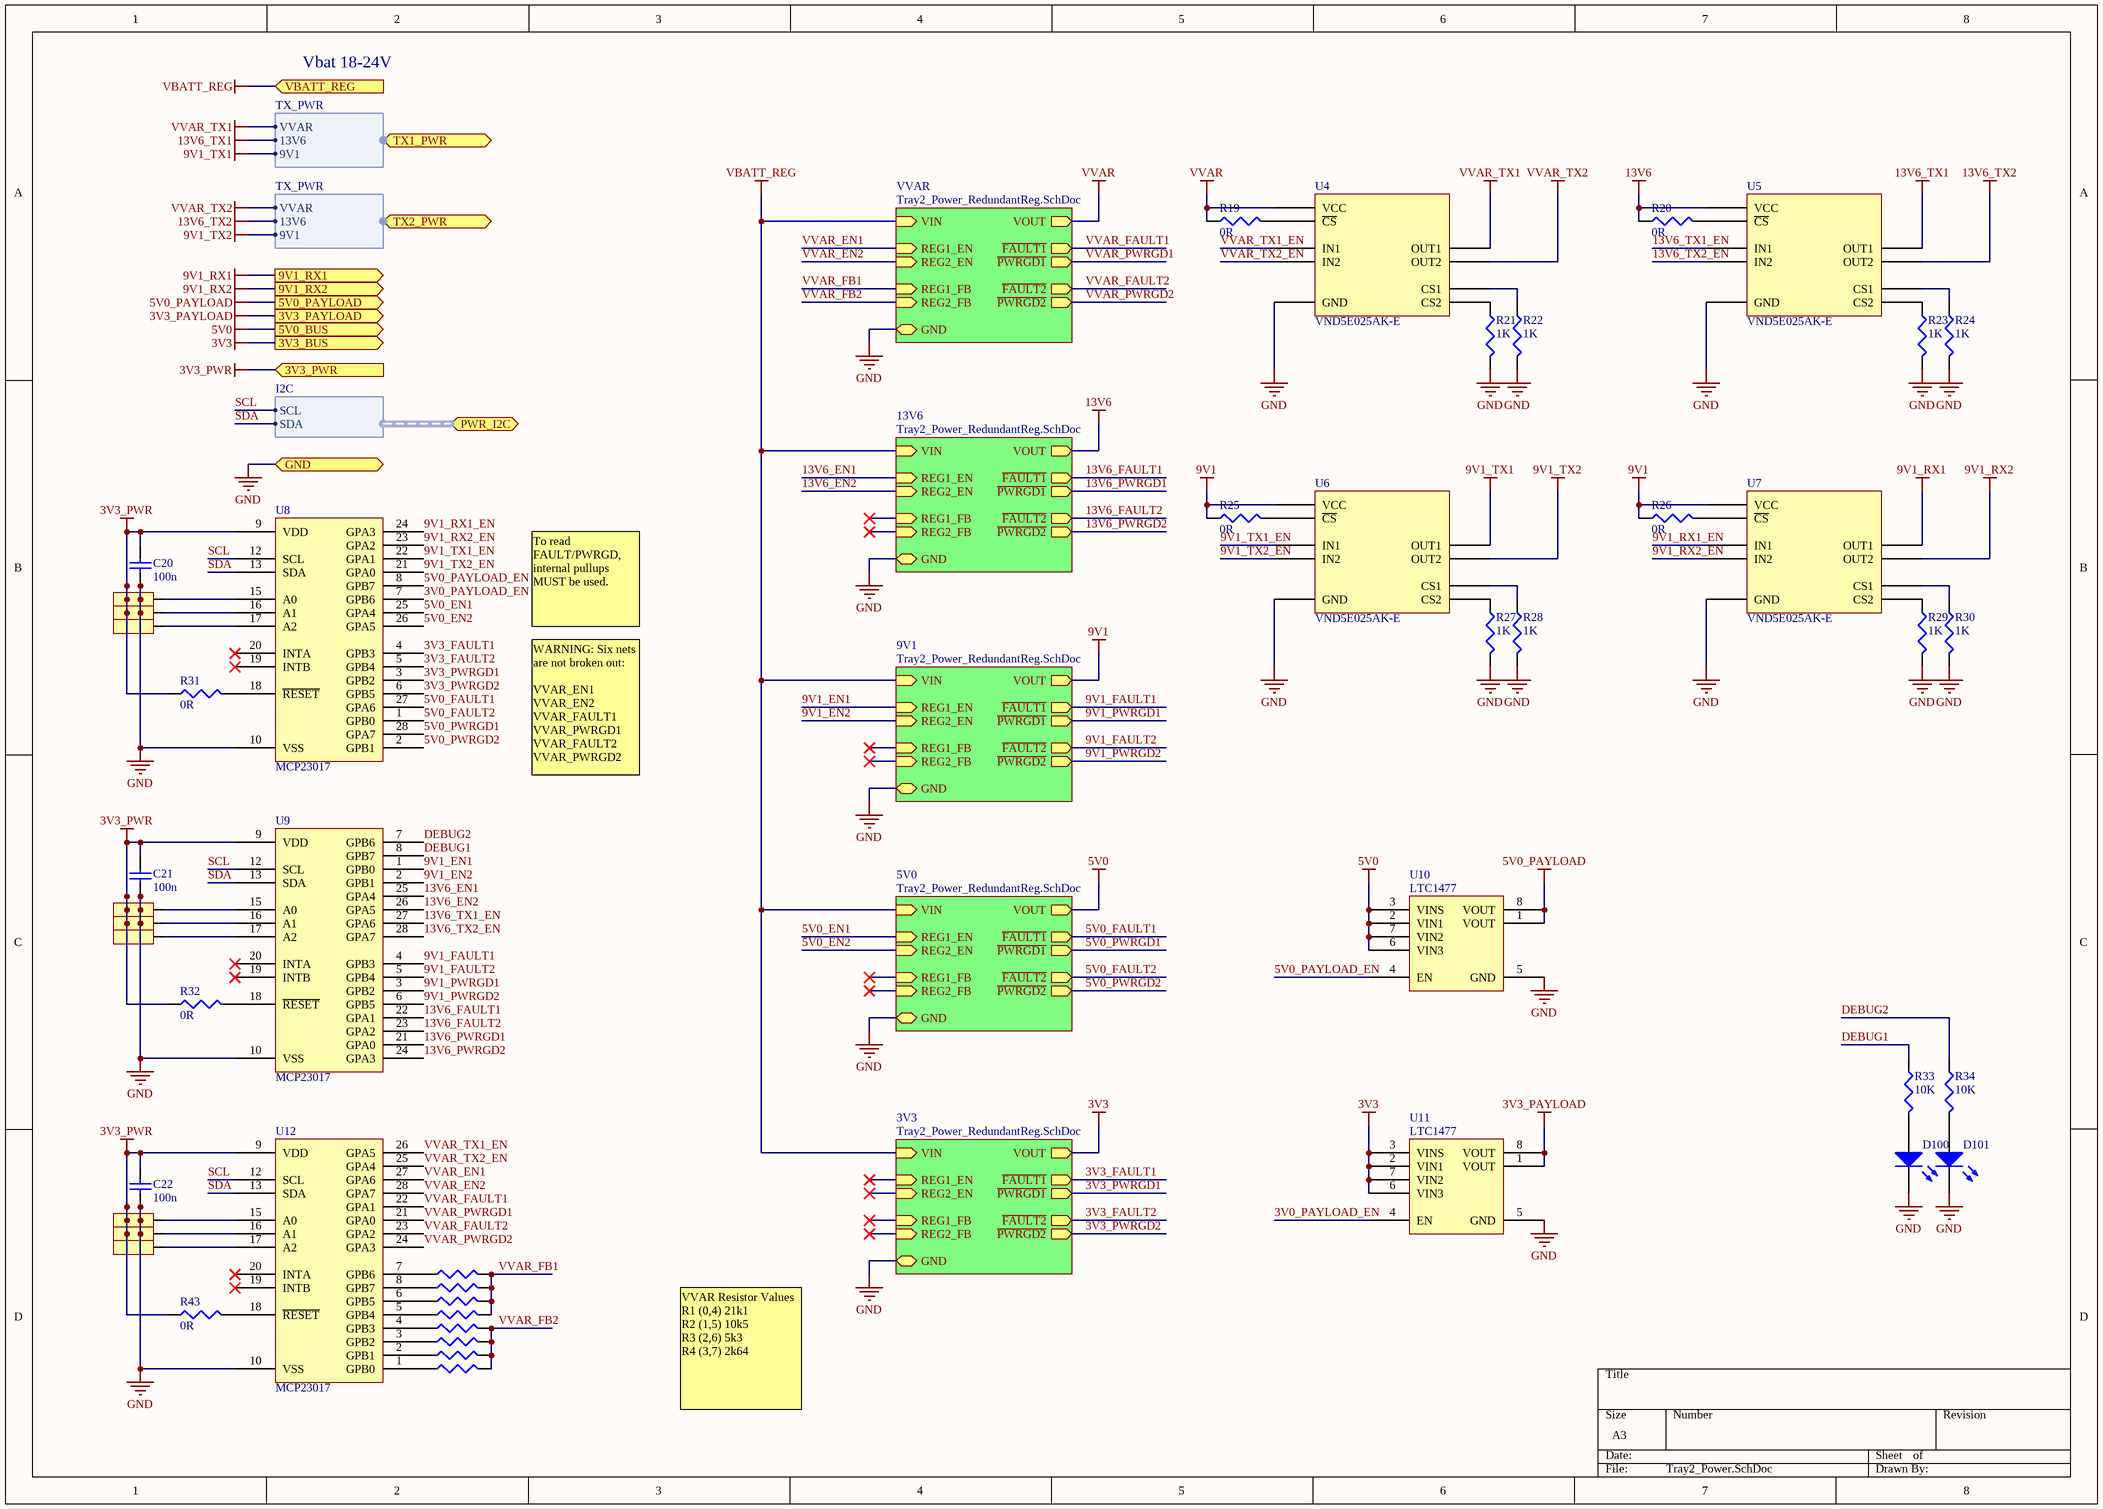
[diagram p5: Tray2_Power.SchDoc]

### Parts
C20  value 100n  [R0805M]
C21  value 100n  [R0805M]
C22  value 100n  [R0805M]
D100  LED0  [R0805M]  (value not drawn)
D101  LED0  [R0805M]  (value not drawn)
J1  3-WAY JUMPER  [J1205M]  (value not drawn)
J2  3-WAY JUMPER  [J1205M]  (value not drawn)
J3  3-WAY JUMPER  [J1205M]  (value not drawn)
J4  3-WAY JUMPER  [J1205M]  (value not drawn)
J5  3-WAY JUMPER  [J1205M]  (value not drawn)
J6  3-WAY JUMPER  [J1205M]  (value not drawn)
J7  3-WAY JUMPER  [J1205M]  (value not drawn)
J8  3-WAY JUMPER  [J1205M]  (value not drawn)
J9  3-WAY JUMPER  [J1205M]  (value not drawn)
R19  value 0R  [R0402M]
R20  value 0R  [R0402M]
R21  value 1K  [R0402M]
R22  value 1K  [R0402M]
R23  value 1K  [R0402M]
R24  value 1K  [R0402M]
R25  value 0R  [R0402M]
R26  value 0R  [R0402M]
R27  value 1K  [R0402M]
R28  value 1K  [R0402M]
R29  value 1K  [R0402M]
R30  value 1K  [R0402M]
R31  value 0R  [R0402M]
R32  value 0R  [R0402M]
R33  value 10K  [R0402M]
R34  value 10K  [R0402M]
R35  VSET_1  [R0805M]  (value not drawn)
R36  VSET_1  [R0805M]  (value not drawn)
R37  VSET_1  [R0805M]  (value not drawn)
R38  VSET_1  [R0805M]  (value not drawn)
R39  VSET_1  [R0805M]  (value not drawn)
R40  VSET_1  [R0805M]  (value not drawn)
R41  VSET_1  [R0805M]  (value not drawn)
R42  VSET_1  [R0805M]  (value not drawn)
R43  value 0R  [R0402M]
U4  VND5E025AK-E  [SSO24]
U5  VND5E025AK-E  [SSO24]
U6  VND5E025AK-E  [SSO24]
U7  VND5E025AK-E  [SSO24]
U8  MCP23017  [SSOP28]
U9  MCP23017  [SSOP28]
U10  LTC1477  [SO8]
U11  LTC1477  [SO8]
U12  MCP23017  [SSOP28]

### Sub-sheets
3V3 = Tray2_Power_RedundantReg.SchDoc (file not in this document): REG1_EN (in), REG2_EN (in), VIN (in), VOUT (out), REG1_FB (in), REG2_FB (in), GND, ~{FAULT1} (out), ~{FAULT2} (out), ~{PWRGD1} (out), ~{PWRGD2} (out)
5V0 = Tray2_Power_RedundantReg.SchDoc (file not in this document): REG1_EN (in), REG2_EN (in), VIN (in), VOUT (out), REG1_FB (in), REG2_FB (in), GND, ~{FAULT1} (out), ~{FAULT2} (out), ~{PWRGD1} (out), ~{PWRGD2} (out)
9V1 = Tray2_Power_RedundantReg.SchDoc (file not in this document): REG1_EN (in), REG2_EN (in), VIN (in), VOUT (out), REG1_FB (in), REG2_FB (in), GND, ~{FAULT1} (out), ~{FAULT2} (out), ~{PWRGD1} (out), ~{PWRGD2} (out)
13V6 = Tray2_Power_RedundantReg.SchDoc (file not in this document): REG1_EN (in), REG2_EN (in), VIN (in), VOUT (out), REG1_FB (in), REG2_FB (in), GND, ~{FAULT1} (out), ~{FAULT2} (out), ~{PWRGD1} (out), ~{PWRGD2} (out)
VVAR = Tray2_Power_RedundantReg.SchDoc (file not in this document): REG1_EN (in), REG2_EN (in), VIN (in), VOUT (out), REG1_FB (in), REG2_FB (in), GND, ~{FAULT1} (out), ~{FAULT2} (out), ~{PWRGD1} (out), ~{PWRGD2} (out)

### Ports
3V3_BUS (out), 3V3_PAYLOAD (out), 3V3_PWR (in), 5V0_BUS (out), 5V0_PAYLOAD (out), 9V1_RX1 (out), 9V1_RX2 (out), GND, PWR_I2C (harness I2C), TX1_PWR (harness TX_PWR), TX2_PWR (harness TX_PWR), VBATT_REG (in)

### Harnesses
I2C: SCL, SDA
TX_PWR: VVAR, 13V6, 9V1

### Nets
3V3: U11.2(VIN1) U11.3(VINS) U11.6(VIN3) U11.7(VIN2) ; port 3V3_BUS, sheet 3V3/VOUT
3V3_PAYLOAD: U11.1(VOUT) U11.8(VOUT) ; port 3V3_PAYLOAD
3V3_PWR: C20.1 C21.1 C22.1 J1.1 J2.1 J3.1 J4.1 J5.1 J6.1 J7.1 J8.1 J9.1 R31.1 R32.1 R43.1 U8.9(VDD) U9.9(VDD) U12.9(VDD) ; port 3V3_PWR
5V0: U10.2(VIN1) U10.3(VINS) U10.6(VIN3) U10.7(VIN2) ; port 5V0_BUS, sheet 5V0/VOUT
5V0_PAYLOAD: U10.1(VOUT) U10.8(VOUT) ; port 5V0_PAYLOAD
9V1: R25.1 R26.1 U6.VCC U7.VCC ; sheet 9V1/VOUT
9V1_RX1: U7.OUT1 ; port 9V1_RX1
9V1_RX2: U7.OUT2 ; port 9V1_RX2
9V1_TX1: U6.OUT1 ; port TX1_PWR.9V1
9V1_TX2: U6.OUT2 ; port TX2_PWR.9V1
13V6: R20.1 U5.VCC ; sheet 13V6/VOUT
13V6_TX1: U5.OUT1 ; port TX1_PWR.13V6
13V6_TX2: U5.OUT2 ; port TX2_PWR.13V6
GND: C20.2 C21.2 C22.2 D100.2(K) D101.2(K) J1.3 J2.3 J3.3 J4.3 J5.3 J6.3 J7.3 J8.3 J9.3 R21.2 R22.2 R23.2 R24.2 R27.2 R28.2 R29.2 R30.2 U4.GND U5.GND U6.GND U7.GND U8.10(VSS) U9.10(VSS) U10.5(GND) U11.5(GND) U12.10(VSS) ; port GND, sheet 13V6/GND, sheet 9V1/GND, sheet 5V0/GND, sheet 3V3/GND, sheet VVAR/GND
VBATT_REG: port VBATT_REG, sheet 13V6/VIN, sheet 9V1/VIN, sheet 5V0/VIN, sheet 3V3/VIN, sheet VVAR/VIN
VVAR: R19.1 U4.VCC ; sheet VVAR/VOUT
VVAR_TX1: U4.OUT1 ; port TX1_PWR.VVAR
VVAR_TX2: U4.OUT2 ; port TX2_PWR.VVAR
3V0_PAYLOAD_EN: U8.7(GPB6) U11.4(EN)
3V3_FAULT1: U8.4(GPB3) ; sheet 3V3/~{FAULT1}
3V3_FAULT2: U8.5(GPB4) ; sheet 3V3/~{FAULT2}
3V3_PWRGD1: U8.3(GPB2) ; sheet 3V3/~{PWRGD1}
3V3_PWRGD2: U8.6(GPB5) ; sheet 3V3/~{PWRGD2}
5V0_EN1: U8.25(GPA4) ; sheet 5V0/REG1_EN
5V0_EN2: U8.26(GPA5) ; sheet 5V0/REG2_EN
5V0_FAULT1: U8.27(GPA6) ; sheet 5V0/~{FAULT1}
5V0_FAULT2: U8.1(GPB0) ; sheet 5V0/~{FAULT2}
5V0_PAYLOAD_EN: U8.8(GPB7) U10.4(EN)
5V0_PWRGD1: U8.28(GPA7) ; sheet 5V0/~{PWRGD1}
5V0_PWRGD2: U8.2(GPB1) ; sheet 5V0/~{PWRGD2}
9V1_EN1: U9.1(GPB0) ; sheet 9V1/REG1_EN
9V1_EN2: U9.2(GPB1) ; sheet 9V1/REG2_EN
9V1_FAULT1: U9.4(GPB3) ; sheet 9V1/~{FAULT1}
9V1_FAULT2: U9.5(GPB4) ; sheet 9V1/~{FAULT2}
9V1_PWRGD1: U9.3(GPB2) ; sheet 9V1/~{PWRGD1}
9V1_PWRGD2: U9.6(GPB5) ; sheet 9V1/~{PWRGD2}
9V1_RX1_EN: U7.IN1 U8.24(GPA3)
9V1_RX2_EN: U7.IN2 U8.23(GPA2)
9V1_TX1_EN: U6.IN1 U8.22(GPA1)
9V1_TX2_EN: U6.IN2 U8.21(GPA0)
13V6_EN1: U9.25(GPA4) ; sheet 13V6/REG1_EN
13V6_EN2: U9.26(GPA5) ; sheet 13V6/REG2_EN
13V6_FAULT1: U9.22(GPA1) ; sheet 13V6/~{FAULT1}
13V6_FAULT2: U9.23(GPA2) ; sheet 13V6/~{FAULT2}
13V6_PWRGD1: U9.21(GPA0) ; sheet 13V6/~{PWRGD1}
13V6_PWRGD2: U9.24(GPA3) ; sheet 13V6/~{PWRGD2}
13V6_TX1_EN: U5.IN1 U9.27(GPA6)
13V6_TX2_EN: U5.IN2 U9.28(GPA7)
DEBUG1: R33.1 U9.8(GPB7)
DEBUG2: R34.1 U9.7(GPB6)
SCL: U8.12(SCL) U9.12(SCL) U12.12(SCL) ; port PWR_I2C.SCL
SDA: U8.13(SDA) U9.13(SDA) U12.13(SDA) ; port PWR_I2C.SDA
VVAR_EN1: U12.27(GPA6) ; sheet VVAR/REG1_EN
VVAR_EN2: U12.28(GPA7) ; sheet VVAR/REG2_EN
VVAR_FAULT1: U12.22(GPA1) ; sheet VVAR/~{FAULT1}
VVAR_FAULT2: U12.23(GPA2) ; sheet VVAR/~{FAULT2}
VVAR_FB1: R35.2 R36.2 R37.2 R38.2 ; sheet VVAR/REG1_FB
VVAR_FB2: R39.2 R40.2 R41.2 R42.2 ; sheet VVAR/REG2_FB
VVAR_PWRGD1: U12.21(GPA0) ; sheet VVAR/~{PWRGD1}
VVAR_PWRGD2: U12.24(GPA3) ; sheet VVAR/~{PWRGD2}
VVAR_TX1_EN: U4.IN1 U12.26(GPA5)
VVAR_TX2_EN: U4.IN2 U12.25(GPA4)
NetD100_1: D100.1(A) R33.2
NetD101_1: D101.1(A) R34.2
NetJ1_2: J1.2 U8.15(A0)
NetJ2_2: J2.2 U8.16(A1)
NetJ3_2: J3.2 U8.17(A2)
NetJ4_2: J4.2 U9.15(A0)
NetJ5_2: J5.2 U9.16(A1)
NetJ6_2: J6.2 U9.17(A2)
NetJ7_2: J7.2 U12.15(A0)
NetJ8_2: J8.2 U12.16(A1)
NetJ9_2: J9.2 U12.17(A2)
NetR19_2: R19.2 U4.CS_DIS(~{CS})
NetR20_2: R20.2 U5.CS_DIS(~{CS})
NetR21_1: R21.1 U4.CS2
NetR22_1: R22.1 U4.CS1
NetR23_1: R23.1 U5.CS2
NetR24_1: R24.1 U5.CS1
NetR25_2: R25.2 U6.CS_DIS(~{CS})
NetR26_2: R26.2 U7.CS_DIS(~{CS})
NetR27_1: R27.1 U6.CS2
NetR28_1: R28.1 U6.CS1
NetR29_1: R29.1 U7.CS2
NetR30_1: R30.1 U7.CS1
NetR31_2: R31.2 U8.18(~{RESET})
NetR32_2: R32.2 U9.18(~{RESET})
NetR35_1: R35.1 U12.7(GPB6)
NetR36_1: R36.1 U12.8(GPB7)
NetR37_1: R37.1 U12.6(GPB5)
NetR38_1: R38.1 U12.5(GPB4)
NetR39_1: R39.1 U12.4(GPB3)
NetR40_1: R40.1 U12.3(GPB2)
NetR41_1: R41.1 U12.2(GPB1)
NetR42_1: R42.1 U12.1(GPB0)
NetR43_2: R43.2 U12.18(~{RESET})

Not connected (* = marked no-connect by the designer): U8 19(INTB)* 20(INTA)*; U9 19(INTB)* 20(INTA)*; U12 19(INTB)* 20(INTA)*

### Notes on the sheet
- Vbat 18-24V
- To read FAULT/PWRGD, internal pullups MUST be used.
- WARNING: Six nets are not broken out:
  VVAR_EN1
  VVAR_EN2
  VVAR_FAULT1
  VVAR_PWRGD1
  VVAR_FAULT2
  VVAR_PWRGD2
- VVAR Resistor Values
  R1 (0,4)	21k1
  R2 (1,5)	10k5
  R3 (2,6)	5k3
  R4 (3,7)	2k64

### Library data of the parts
C20-C22 = Cap: Capacitor; Published: 8-Jun-2000; LatestRevisionDate: 17-Jul-2002; LatestRevisionNote: Re-released for DXP Platform.; PackageReference: RAD-0.3; Publisher: Altium Limited; PackageDescription: Radial Cap, Thru-Hole; 2 Leads; 0.3 in Pin Spacing
D100 D101 = LED0: Typical INFRARED GaAs LED; Published: 8-Jun-2000; LatestRevisionDate: 08-Jul-2005; LatestRevisionNote: Mech Layer 1 removed.; PackageReference: LED-0; Publisher: Altium Limited; PackageDescription: LED; 2 Leads
R19-R43 = Res3: Resistor; Published: 8-Jun-2000; LatestRevisionDate: 29-May-2009; LatestRevisionNote: IPC-7351 Footprint Added.; PackageReference: J1-0603; Publisher: Altium Limited; PackageDescription: Chip Resistor
U4-U7 = VND5E025AK-E: Double channel high-side driver with analog current sense
U8 U9 U12 = MCP23017: 16-Bit I/O Expander with Serial Interface
U10 U11 = LTC1477: Single Protected High Side Switches